# Altium schematic sheet NOVA-Block.SchDoc
size 406 x 355 mm; SheetNumber: 2; SheetTotal: 16
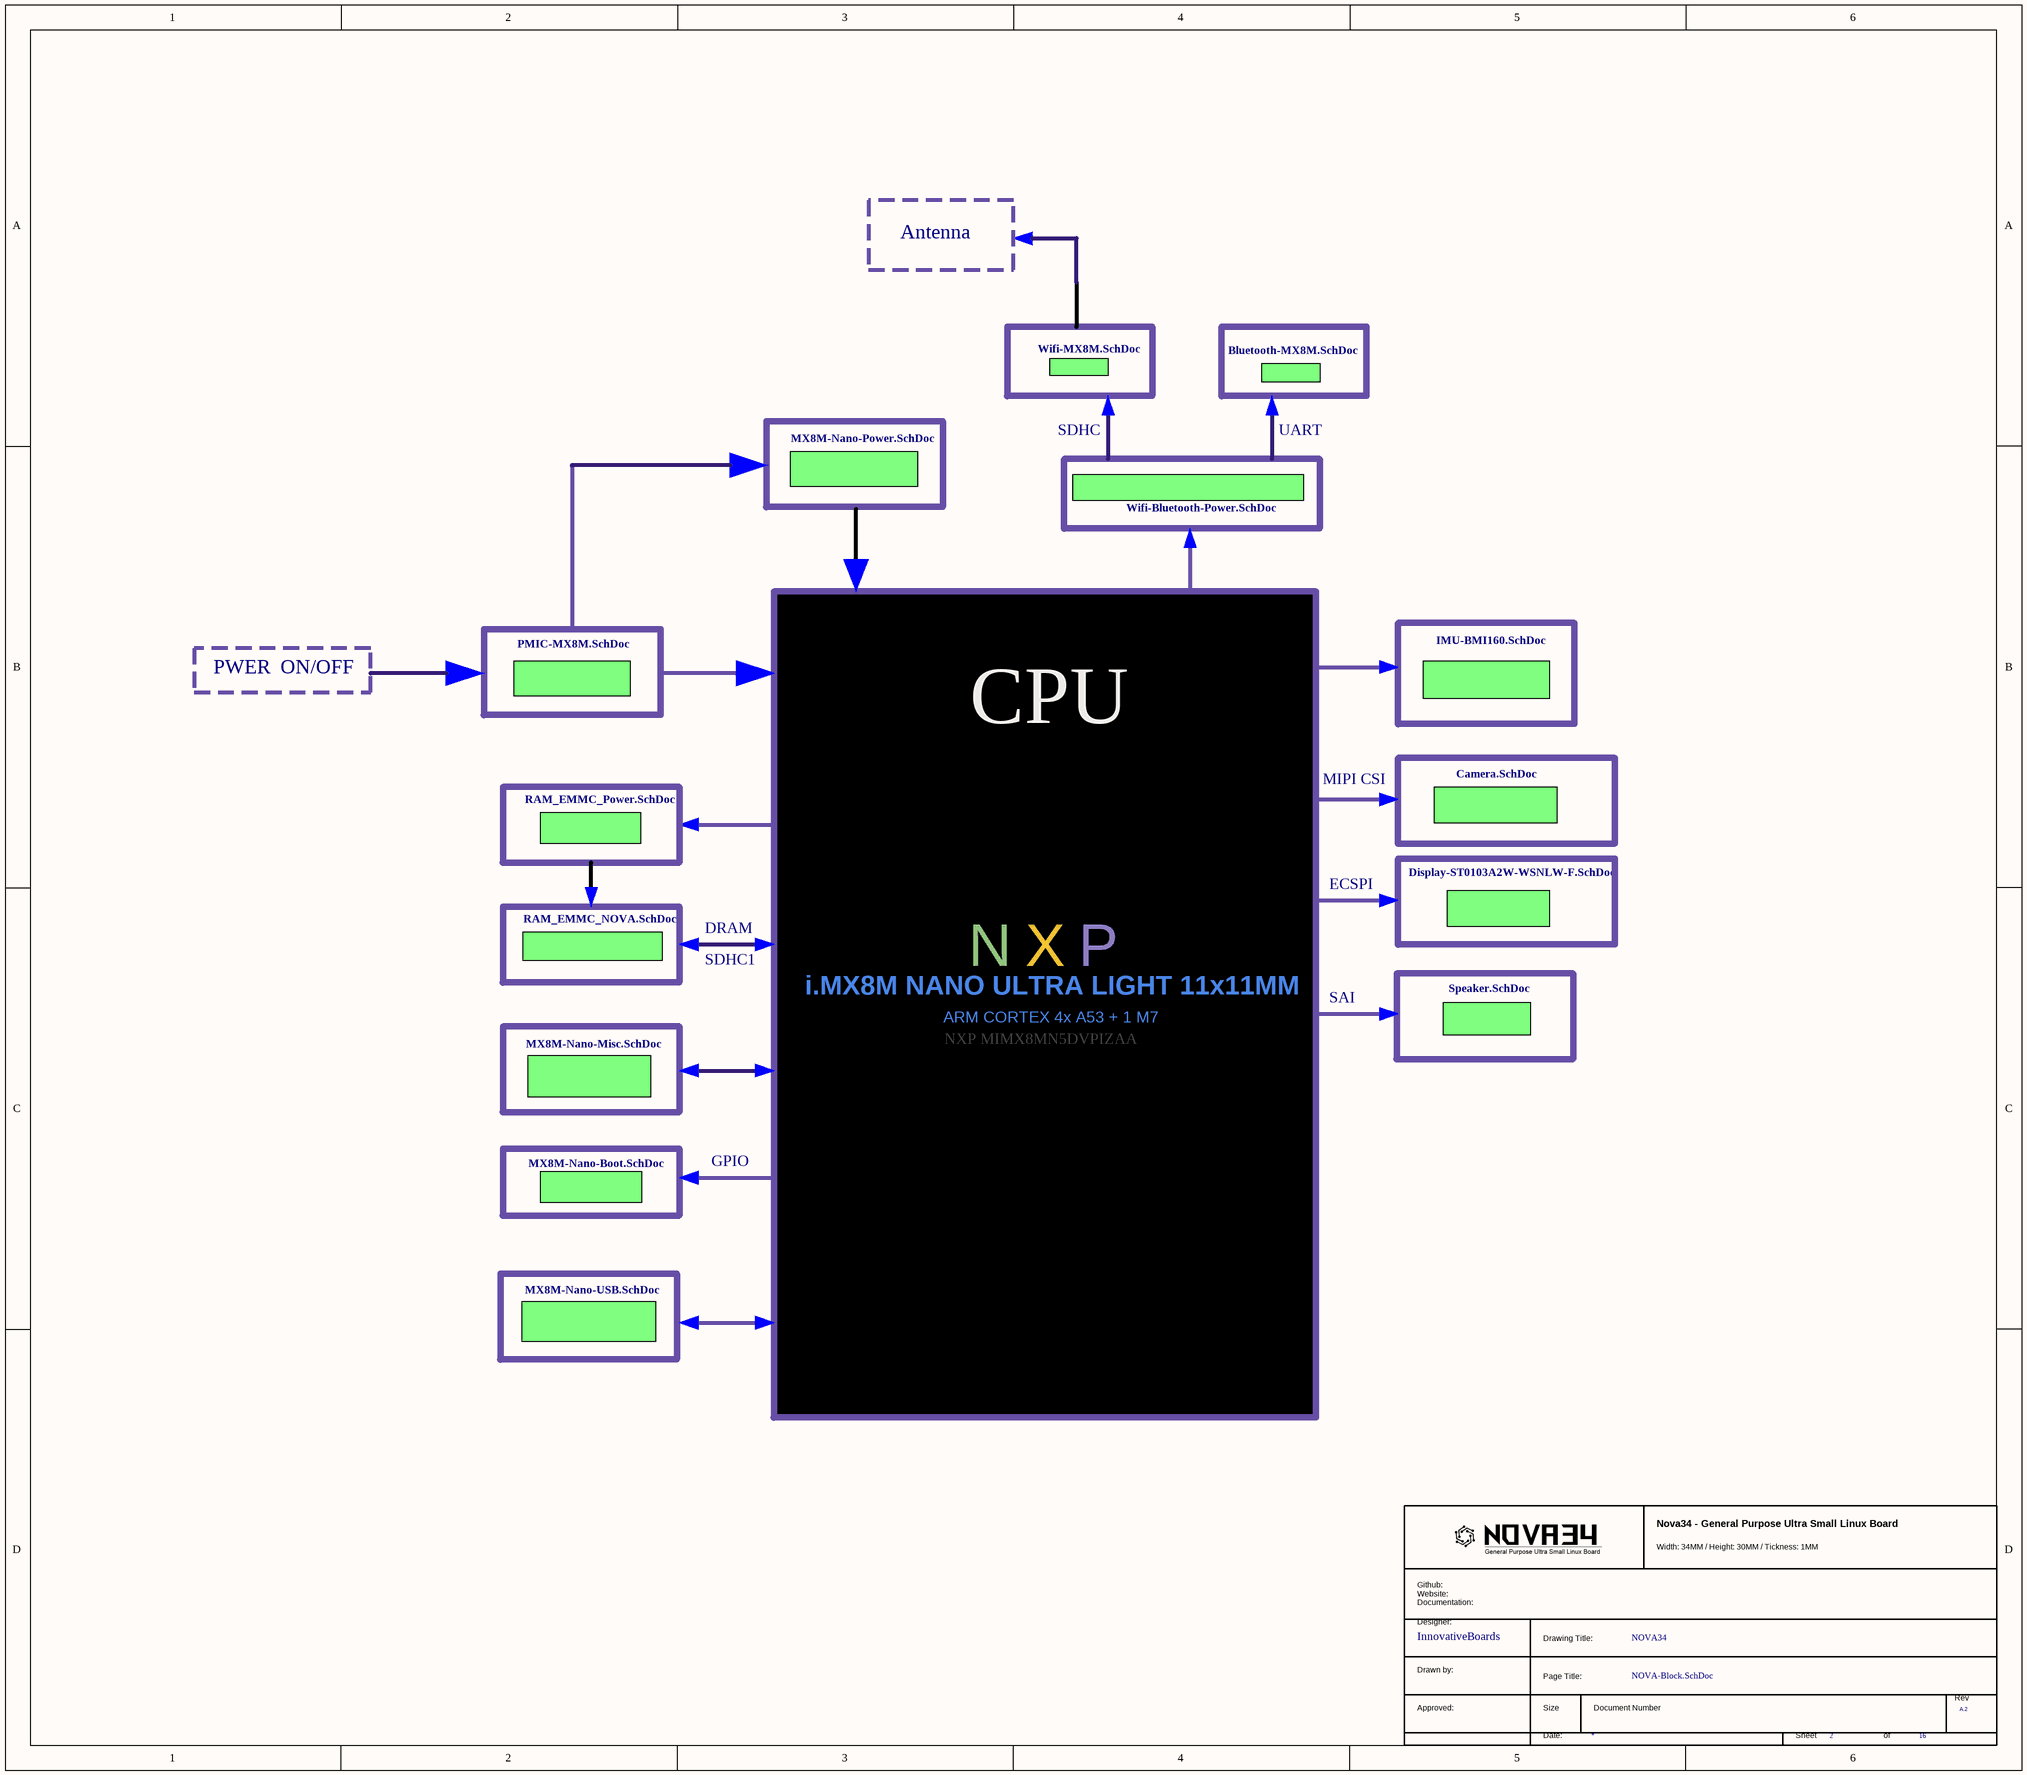
[diagram p0: NOVA-Block.SchDoc]

## Parts
*  RevCode: A.2  (hidden comment: TitleBlock_MCPG)  (graphical)

## Sub-sheets
U_Bluetooth-MX8M = Bluetooth-MX8M.SchDoc: no entries
U_Camera = Camera.SchDoc: no entries
U_Display-ST0103A2W-WSNLW-F = Display-ST0103A2W-WSNLW-F.SchDoc: no entries
U_IMU-BMI160 = IMU-BMI160.SchDoc: no entries
U_MX8M-Nano-Boot = MX8M-Nano-Boot.SchDoc: no entries
U_MX8M-Nano-Misc = MX8M-Nano-Misc.SchDoc: no entries
U_MX8M-Nano-Power = MX8M-Nano-Power.SchDoc: no entries
U_MX8M-Nano-USB = MX8M-Nano-USB.SchDoc: no entries
U_PMIC-MX8M = PMIC-MX8M.SchDoc: no entries
U_RAM_EMMC_NOVA = RAM_EMMC_NOVA.SchDoc: no entries
U_RAM_EMMC_Power = RAM_EMMC_Power.SchDoc: no entries
U_Speaker = Speaker.SchDoc: no entries
U_Wifi-Bluetooth-Power = Wifi-Bluetooth-Power.SchDoc: no entries
U_Wifi-MX8M = Wifi-MX8M.SchDoc: no entries

## Notes on the sheet
- Antenna
- SDHC
- UART
- PWER  ON/OFF
- CPU
- MIPI CSI
- ECSPI
- SDHC1
- DRAM
- N
- X
- P
- i.MX8M NANO ULTRA LIGHT 11x11MM
- ARM CORTEX 4x A53 + 1 M7
- SAI
- NXP MIMX8MN5DVPIZAA
- GPIO
- (in symbol TitleBlock_MCPG) Nova34 - General Purpose Ultra Small Linux Board; Width: 34MM / Height: 30MM / Tickness: 1MM; Github: / Website: / Documentation:; Designer:; InnovativeBoards; Drawing Title:; NOVA34; Drawn by:; Page Title:; Rev; Approved:; Size; Document Number; Date:; Sheet; of

## Library data of the parts
* = TitleBlock_MCPG: Page Create Date: March  8, 1995